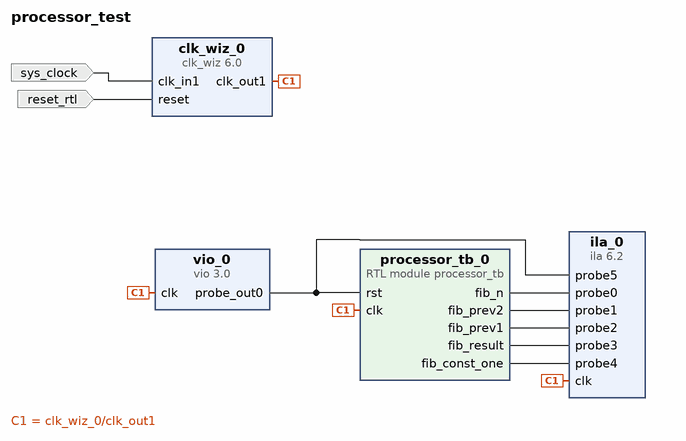
[diagram p0: block diagram of the top level]
# Vivado block design processor_test, xc7z020clg400-1, Vivado 2020.2
create_bd_design processor_test

create_bd_port -dir I -type clk sys_clock
set_property -dict {CONFIG.FREQ_HZ 125000000 CONFIG.PHASE 0.000} [get_bd_ports sys_clock]
create_bd_port -dir I -type rst reset_rtl
set_property -dict {CONFIG.POLARITY ACTIVE_HIGH} [get_bd_ports reset_rtl]

create_bd_cell -type ip -vlnv xilinx.com:ip:vio:3.0 vio_0
set_property -dict {CONFIG.C_NUM_PROBE_IN 0 CONFIG.C_NUM_PROBE_OUT 1} [get_bd_cells vio_0]
create_bd_cell -type ip -vlnv xilinx.com:ip:ila:6.2 ila_0
set_property -dict [list \
  CONFIG.ALL_PROBE_SAME_MU_CNT 2 \
  CONFIG.C_ADV_TRIGGER true \
  CONFIG.C_DATA_DEPTH 8192 \
  CONFIG.C_ENABLE_ILA_AXI_MON false \
  CONFIG.C_EN_STRG_QUAL 1 \
  CONFIG.C_MONITOR_TYPE Native \
  CONFIG.C_NUM_OF_PROBES 6 \
  CONFIG.C_PROBE0_MU_CNT 2 \
  CONFIG.C_PROBE0_WIDTH 32 \
  CONFIG.C_PROBE1_MU_CNT 2 \
  CONFIG.C_PROBE1_WIDTH 32 \
  CONFIG.C_PROBE2_MU_CNT 2 \
  CONFIG.C_PROBE2_WIDTH 32 \
  CONFIG.C_PROBE3_MU_CNT 2 \
  CONFIG.C_PROBE3_WIDTH 32 \
  CONFIG.C_PROBE4_MU_CNT 2 \
  CONFIG.C_PROBE4_WIDTH 32 \
  CONFIG.C_PROBE5_MU_CNT 2 \
  CONFIG.C_TRIGOUT_EN false \
] [get_bd_cells ila_0]
create_bd_cell -type ip -vlnv xilinx.com:ip:clk_wiz:6.0 clk_wiz_0
set_property -dict [list \
  CONFIG.CLKOUT1_JITTER 172.798 \
  CONFIG.CLKOUT1_REQUESTED_OUT_FREQ 20 \
  CONFIG.CLK_IN1_BOARD_INTERFACE sys_clock \
  CONFIG.MMCM_CLKOUT0_DIVIDE_F 50.000 \
  CONFIG.RESET_PORT reset \
  CONFIG.RESET_TYPE ACTIVE_HIGH \
  CONFIG.USE_BOARD_FLOW true \
] [get_bd_cells clk_wiz_0]
create_bd_cell -type module -reference processor_tb processor_tb_0

# ---- connections ----

connect_bd_net [get_bd_pins vio_0/probe_out0] [get_bd_pins processor_tb_0/rst] [get_bd_pins ila_0/probe5]
connect_bd_net [get_bd_pins processor_tb_0/fib_n] [get_bd_pins ila_0/probe0]
connect_bd_net [get_bd_pins processor_tb_0/fib_prev2] [get_bd_pins ila_0/probe1]
connect_bd_net [get_bd_pins processor_tb_0/fib_prev1] [get_bd_pins ila_0/probe2]
connect_bd_net [get_bd_pins processor_tb_0/fib_result] [get_bd_pins ila_0/probe3]
connect_bd_net [get_bd_pins processor_tb_0/fib_const_one] [get_bd_pins ila_0/probe4]
connect_bd_net [get_bd_ports sys_clock] [get_bd_pins clk_wiz_0/clk_in1]
connect_bd_net [get_bd_pins clk_wiz_0/clk_out1] [get_bd_pins ila_0/clk] [get_bd_pins vio_0/clk] [get_bd_pins processor_tb_0/clk]
connect_bd_net [get_bd_ports reset_rtl] [get_bd_pins clk_wiz_0/reset]

validate_bd_design
save_bd_design
